# EAGLE design controller_v2 (EAGLE 7.1.0)
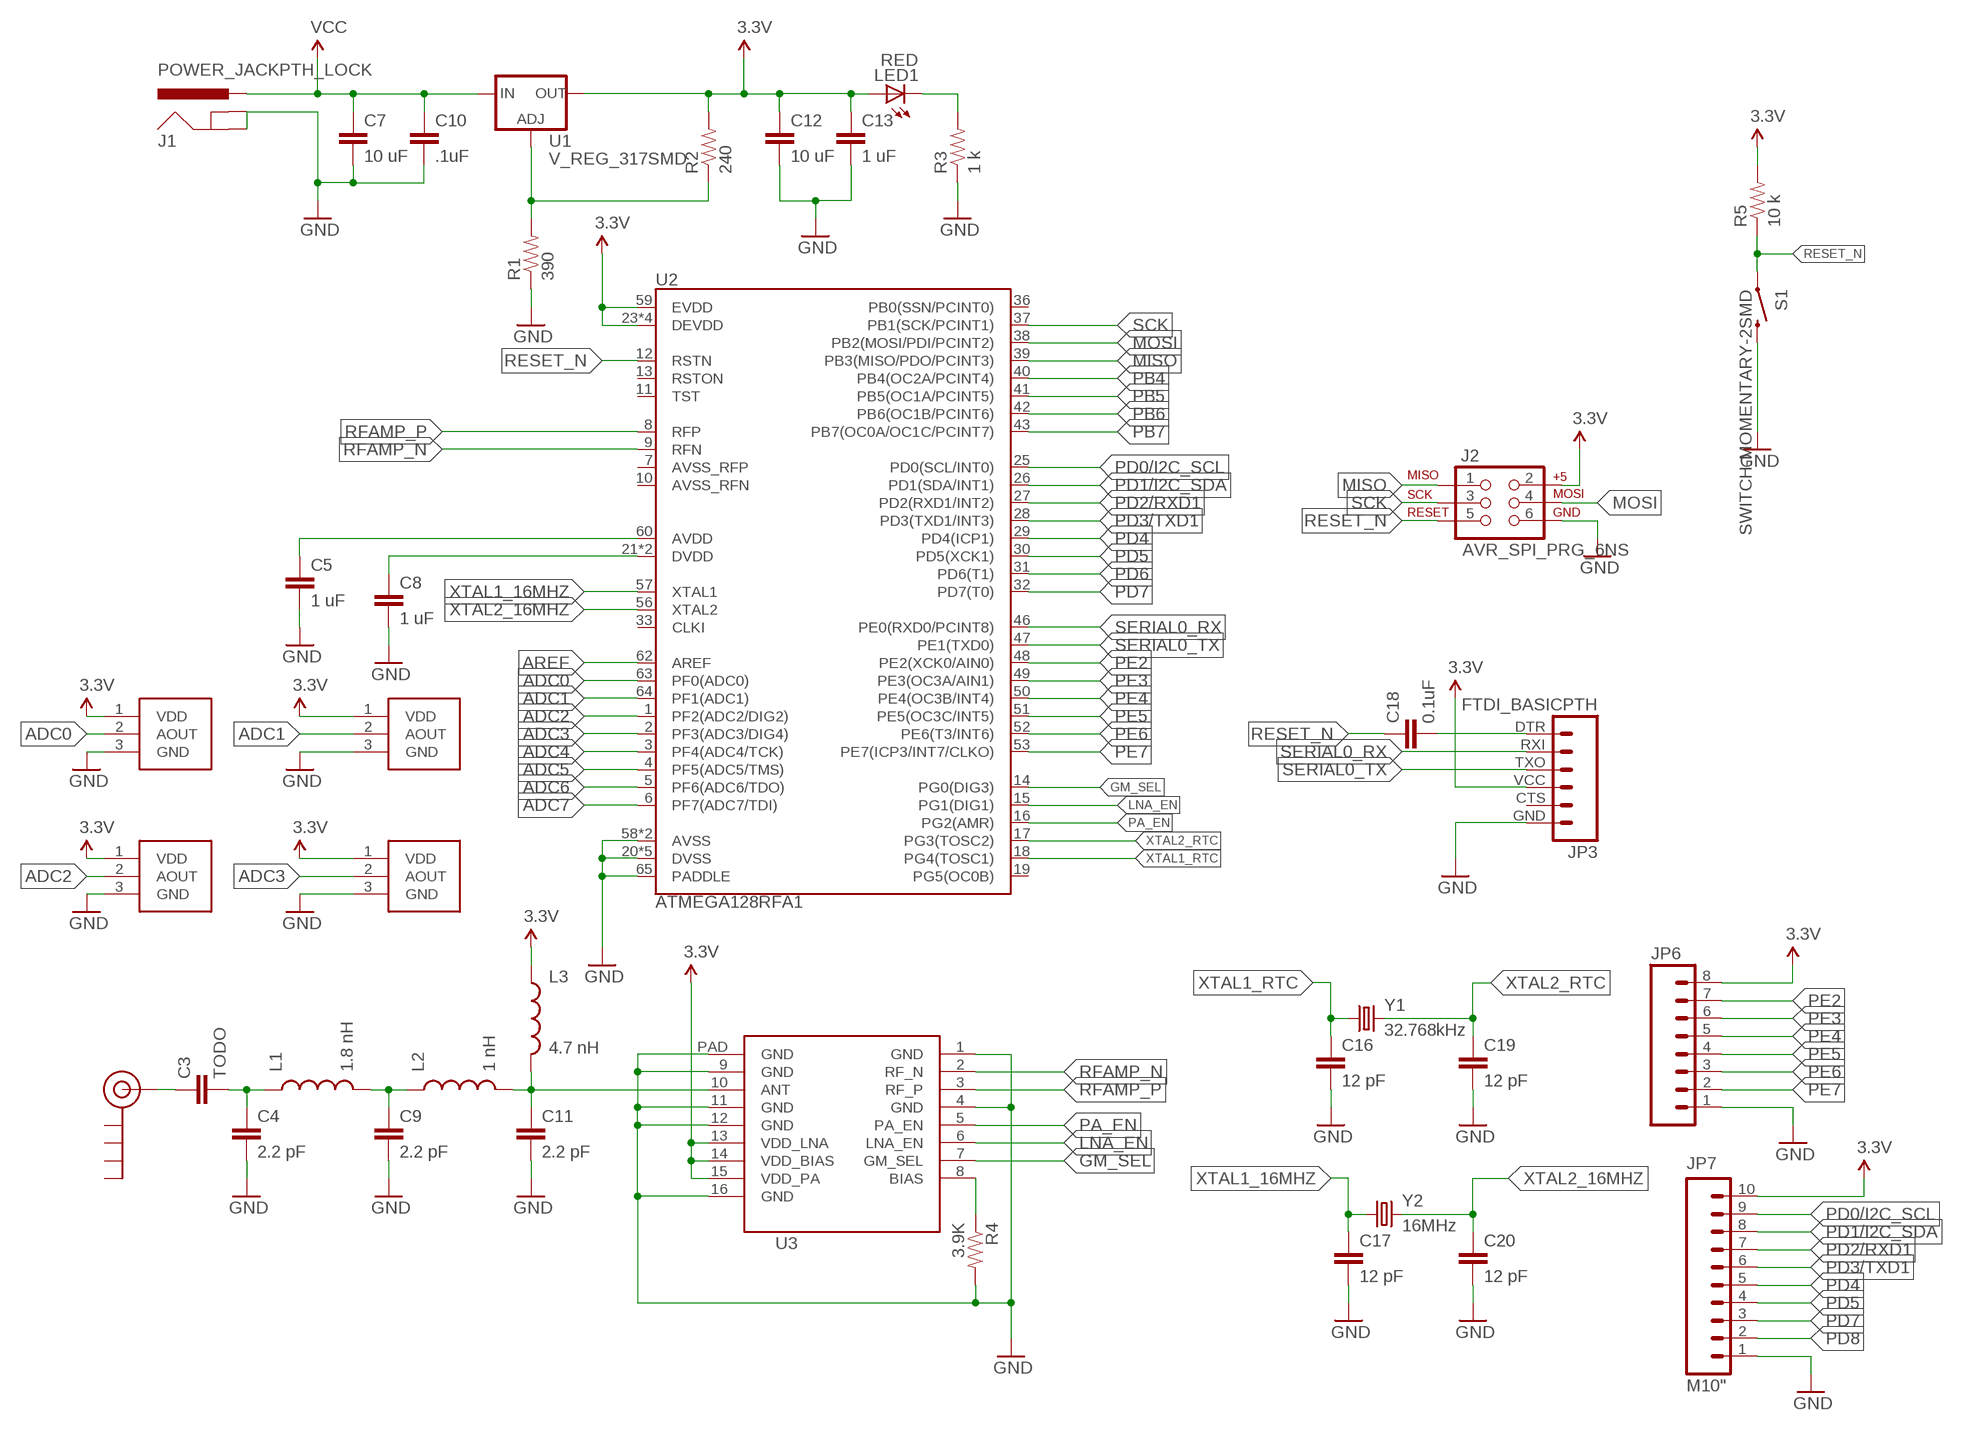
[diagram p0: schematic, sheet 1]

## Parts
C3  TODO  CAP0805  [0805]
C4  2.2 pF  CAP0805  [0805]
C5  1 uF  CAP0805  [0805]
C7  10 uF  CAP0805  [0805]
C8  1 uF  CAP0805  [0805]
C9  2.2 pF  CAP0805  [0805]
C10  .1uF  CAP0805  [0805]
C11  2.2 pF  CAP0805  [0805]
C12  10 uF  CAP0805  [0805]
C13  1 uF  CAP0805  [0805]
C16  12 pF  CAP0805  [0805]
C17  12 pF  CAP0805  [0805]
C18  0.1uF  CAP0805  [0805]
C19  12 pF  CAP0805  [0805]
C20  12 pF  CAP0805  [0805]
J1  POWER_JACKPTH_LOCK  [POWER_JACK_PTH_LOCK]
J2  AVR_SPI_PRG_6NS  [2X3-NS]
J3  GIMBAL_3PIN  [JST-3-PTH]
J4  GIMBAL_3PIN  [JST-3-PTH]
J5  GIMBAL_3PIN  [JST-3-PTH]
J6  GIMBAL_3PIN  [JST-3-PTH]
J$1  SMA_EDGE  [SMA-EDGE]
JP3  FTDI_BASICPTH  [FTDI_BASIC]
JP6  M081X08  [1X08]
JP7  M10"  [1X10]
L1  1.8 nH  INDUCTOR0805  [0805]
L2  1 nH  INDUCTOR0805  [0805]
L3  4.7 nH  INDUCTOR0805  [0805]
LED1  RED  LED0603  [LED-0603]
R1  390  RESISTOR0805-RES  [0805]
R2  240  RESISTOR0805-RES  [0805]
R3  1 k  RESISTOR0805-RES  [0805]
R4  3.9K  RESISTOR0805-RES  [0805]
R5  10 k  RESISTOR0805-RES  [0805]
S1  SWITCH-MOMENTARY-2SMD  [TACTILE_SWITCH_SMD]
U1  V_REG_317SMD  [SOT223]
U2  ATMEGA128RFA1  [QFN-64]
U3  RF_AMPLIFIER  CC2592QF  [QFN65P400X400X100-17N]
Y1  32.768kHz  CRYSTAL32-SMD  [CRYSTAL-32KHZ-SMD]
Y2  16MHz  CRYSTAL5X3  [CRYSTAL-SMD-5X3]

## Nets
3.3V: C12.1 C13.1 J2.2 J3.1(VDD) J4.1(VDD) J5.1(VDD) J6.1(VDD) JP3.VCC JP6.8 JP7.10 L3.1 LED1.A R2.2 R5.2 U1.2(OUT) U2.23(DEVDD) U2.34(DEVDD) U2.44(DEVDD) U2.54(DEVDD) U2.59(EVDD) U3.13(VDD_LNA) U3.14(VDD_BIAS) U3.15(VDD_PA)
ADC0: J6.2(AOUT) U2.63(PF0(ADC0))
ADC1: J3.2(AOUT) U2.64(PF1(ADC1))
ADC2: J5.2(AOUT) U2.1(PF2(ADC2/DIG2))
ADC3: J4.2(AOUT) U2.2(PF3(ADC3/DIG4))
ADC4: U2.3(PF4(ADC4/TCK))
ADC5: U2.4(PF5(ADC5/TMS))
ADC6: U2.5(PF6(ADC6/TDO))
ADC7: U2.6(PF7(ADC7/TDI))
AREF: U2.62(AREF)
GM_SEL: U2.14(PG0(DIG3)) U3.7(GM_SEL)
GND: C4.2 C5.2 C7.2 C8.2 C9.2 C10.2 C11.2 C12.2 C13.2 C16.2 C17.2 C19.2 C20.2 J1.GND J1.GNDBREAK J2.6 J3.3(GND) J4.3(GND) J5.3(GND) J6.3(GND) JP3.GND JP6.1 JP7.1 R1.1 R3.1 R4.2 S1.3 U2.20(DVSS) U2.24(DVSS) U2.35(DVSS) U2.45(DVSS) U2.55(DVSS) U2.58(AVSS) U2.61(AVSS) U2.65(PADDLE) U3.1(GND) U3.4(GND) U3.9(GND) U3.11(GND) U3.12(GND) U3.16(GND) U3.PAD(GND)
LNA_EN: U2.15(PG1(DIG1)) U3.6(LNA_EN)
MISO: J2.1 U2.39(PB3(MISO/PDO/PCINT3))
MOSI: J2.4 U2.38(PB2(MOSI/PDI/PCINT2))
N$1: C9.1 L1.2 L2.1
N$2: C18.2 JP3.DTR
N$3: C11.1 L2.2 L3.2 U3.10(ANT)
N$4: C3.2 C4.1 L1.1
N$7: R4.1 U3.8(BIAS)
N$8: C3.1 J$1.SIG(SIGNAL)
N$13: R1.2 R2.1 U1.1(ADJ)
N$14: LED1.C R3.2
N$15: C5.1 U2.60(AVDD)
N$16: C8.1 U2.21(DVDD) U2.22(DVDD)
PA_EN: U2.16(PG2(AMR)) U3.5(PA_EN)
PB4: U2.40(PB4(OC2A/PCINT4))
PB5: U2.41(PB5(OC1A/PCINT5))
PB6: U2.42(PB6(OC1B/PCINT6))
PB7: U2.43(PB7(OC0A/OC1C/PCINT7))
PD0/I2C_SCL: JP7.9 U2.25(PD0(SCL/INT0))
PD1/I2C_SDA: JP7.8 U2.26(PD1(SDA/INT1))
PD2/RXD1: JP7.7 U2.27(PD2(RXD1/INT2))
PD3/TXD1: JP7.6 U2.28(PD3(TXD1/INT3))
PD4: JP7.5 U2.29(PD4(ICP1))
PD5: JP7.4 U2.30(PD5(XCK1))
PD6: U2.31(PD6(T1))
PD7: JP7.3 U2.32(PD7(T0))
PD8: JP7.2
PE2: JP6.7 U2.48(PE2(XCK0/AIN0))
PE3: JP6.6 U2.49(PE3(OC3A/AIN1))
PE4: JP6.5 U2.50(PE4(OC3B/INT4))
PE5: JP6.4 U2.51(PE5(OC3C/INT5))
PE6: JP6.3 U2.52(PE6(T3/INT6))
PE7: JP6.2 U2.53(PE7(ICP3/INT7/CLKO))
RESET_N: C18.1 J2.5 R5.1 S1.1 U2.12(RSTN)
RFAMP_N: U2.9(RFN) U3.2(RF_N)
RFAMP_P: U2.8(RFP) U3.3(RF_P)
SCK: J2.3 U2.37(PB1(SCK/PCINT1))
SERIAL0_RX: JP3.RXI U2.46(PE0(RXD0/PCINT8))
SERIAL0_TX: JP3.TXO U2.47(PE1(TXD0))
VCC: C7.1 C10.1 J1.PWR U1.3(IN)
XTAL1_16MHZ: C17.1 U2.57(XTAL1) Y2.1
XTAL1_RTC: C16.1 U2.18(PG4(TOSC1)) Y1.X1
XTAL2_16MHZ: C20.1 U2.56(XTAL2) Y2.3
XTAL2_RTC: C19.1 U2.17(PG3(TOSC2)) Y1.X2
Unconnected: J$1.GND@0(GND) J$1.GND@1(GND) J$1.GND@2(GND) J$1.GND@3(GND) JP3.CTS U2.7(AVSS_RFP) U2.10(AVSS_RFN) U2.11(TST) U2.13(RSTON) U2.19(PG5(OC0B)) U2.33(CLKI) U2.36(PB0(SSN/PCINT0))

## Library data of the parts
C3-C5 C8 C9 C11 C16-C20 = Controller:CAP: Capacitor Standard 0603 ceramic capacitor, and 0.1" leaded capacitor.
C7 C10 C12 C13 = ATmega128RFA1-DevBoard:CAP: Capacitor Standard 0603 ceramic capacitor, and 0.1" leaded capacitor.
J1 = Controller:POWER_JACK: Power Jack This is the standard 5.5mm barrel jack for power. The PTH is the most common, proven, reliable, footprint. The Slot footprint only works if the mill layer is transmitted to the PCB fab house so be warned. Spark Fun Electronics SKU : PRT-00119 SMT: CONN-08106 Mating wall wart : TOL-00298 (and others)
J2 = Controller:AVR_SPI_PRG_6: AVR ISP 6 Pin This is the reduced ISP connector for AVR programming. Common on Arduino. This footprint will take up less PCB space and can be used with a 10-pin to 6-pin adapter such as SKU: BOB-08508
J3-J6 = Controller:GIMBAL_3PIN: This is the surface mount connector for the 9XR Replacement Gimbal. It uses a 3 Pin, 2 mm Pitch, JST connector (https://www.sparkfun.com/products/9750) You can see the analog transmitter here: http://www.hobbyking.com/hobbyking/store/__39505__Transmitter_Gimbal_Set_Left_Turnigy_9XR_Transmitter_Mode_1.html The black wire is VDD, the White wire is Ground, the Red wire is Analog Out Author: Dustin Richmond Created: 10/25/2014
J$1 = Controller:SMA_EDGE: SMA Antenna Connector End launch SMA connector. The paste layer has been removed so that the connector can be hand soldered onto the board after reflow.
JP3 = Controller:FTDI_BASIC: FTDI Basic header with labels
JP6 = Controller:M08: Header 8 Standard 8-pin 0.1" header. Use with straight break away headers (SKU : PRT-00116), right angle break away headers (PRT-00553), swiss pins (PRT-00743), machine pins (PRT-00117), and female headers (PRT-00115).
JP7 = Controller:M10: Header 10 Standard 10-pin 0.1" header. Use with straight break away headers (SKU : PRT-00116), right angle break away headers (PRT-00553), swiss pins (PRT-00743), machine pins (PRT-00117), and female headers (PRT-00115).
L1-L3 = Controller:INDUCTOR: Inductors Basic Inductor/Choke - 0603 and 1206. Footprints are not proven and vary greatly between part numbers. SRN6045- 33uH, 20% 1.4A SDR0403-560KL - 56uH, 10%, 500mA RMS/740mA peak
LED1 = Controller:LED: LEDs Standard schematic elements and footprints for 5mm, 3mm, 1206, and 0603 sized LEDs. 5mm - Spark Fun Electronics SKU : COM-00529 (and others)
R1 R2 = ATmega128RFA1-DevBoard:RESISTOR: Resistor Basic schematic elements and footprints for 0603, 1206, and PTH resistors.
R3-R5 = Controller:RESISTOR: Resistor Basic schematic elements and footprints for 0603, 1206, and PTH resistors.
S1 = Controller:SWITCH-MOMENTARY-2: Various NO switches- pushbuttons, reed, etc
U1 = Controller:V_REG_317: Voltage Regulator Standard LM317 adjustable voltage regulator. AOI (Adjust Output Input). Google 'LM317 Calculator' for easy to use app to get the two resistor values needed. 240/720 for 5V output. 240/390 for 3.3V output. Spark Fun Electronics SKU : COM-00527
U2 = Controller:ATMEGA128RFA1: ATmega128RFA1 8-bit AVR Microcontroller with Low Power 2.4GHz Transceiver for ZigBee and IEEE 802.15.4
U3 = Controller:CC2592: Device Symbol for the CC2592 QFN16 RF Amplifier Chip from Texas Instruments. Description: The CC2592 device is a cost-effective and high-performance RF front end for low-power and low-voltage 2.4-GHz wireless applications.The CC2592 device is a range extender for all CC25XX 2.4-GHz low-power RF transceivers, transmitters, and system-on-chip products from Texas Instruments.To increase the link budget, the CC2592 device provides a power amplifier for increased output power and an LNA with a low-noise figure for improved receiver sensitivity.The CC2592 device provides a very small size, high-output power RF design with its 4-mm × 4-mm QFN-16 package.The CC2592 device contains PA, LNA, switches, RF-matching, and balun for simple design of high-performance wireless applications Datasheet: http://www.ti.com/general/docs/lit/getliterature.tsp?genericPartNumber=cc2592&fileType=pdf Note: I have NOT added the thermal pads expected in the datasheet. These should be added by the end user on their PCB Author: Dustin Richmond Date Created: 10/16/2014 Reviewer 1: Reviewer 2:
Y1 Y2 = Controller:CRYSTAL: Various standard crystals. Proven footprints. Spark Fun Electronics SKU : COM-00534

## Board
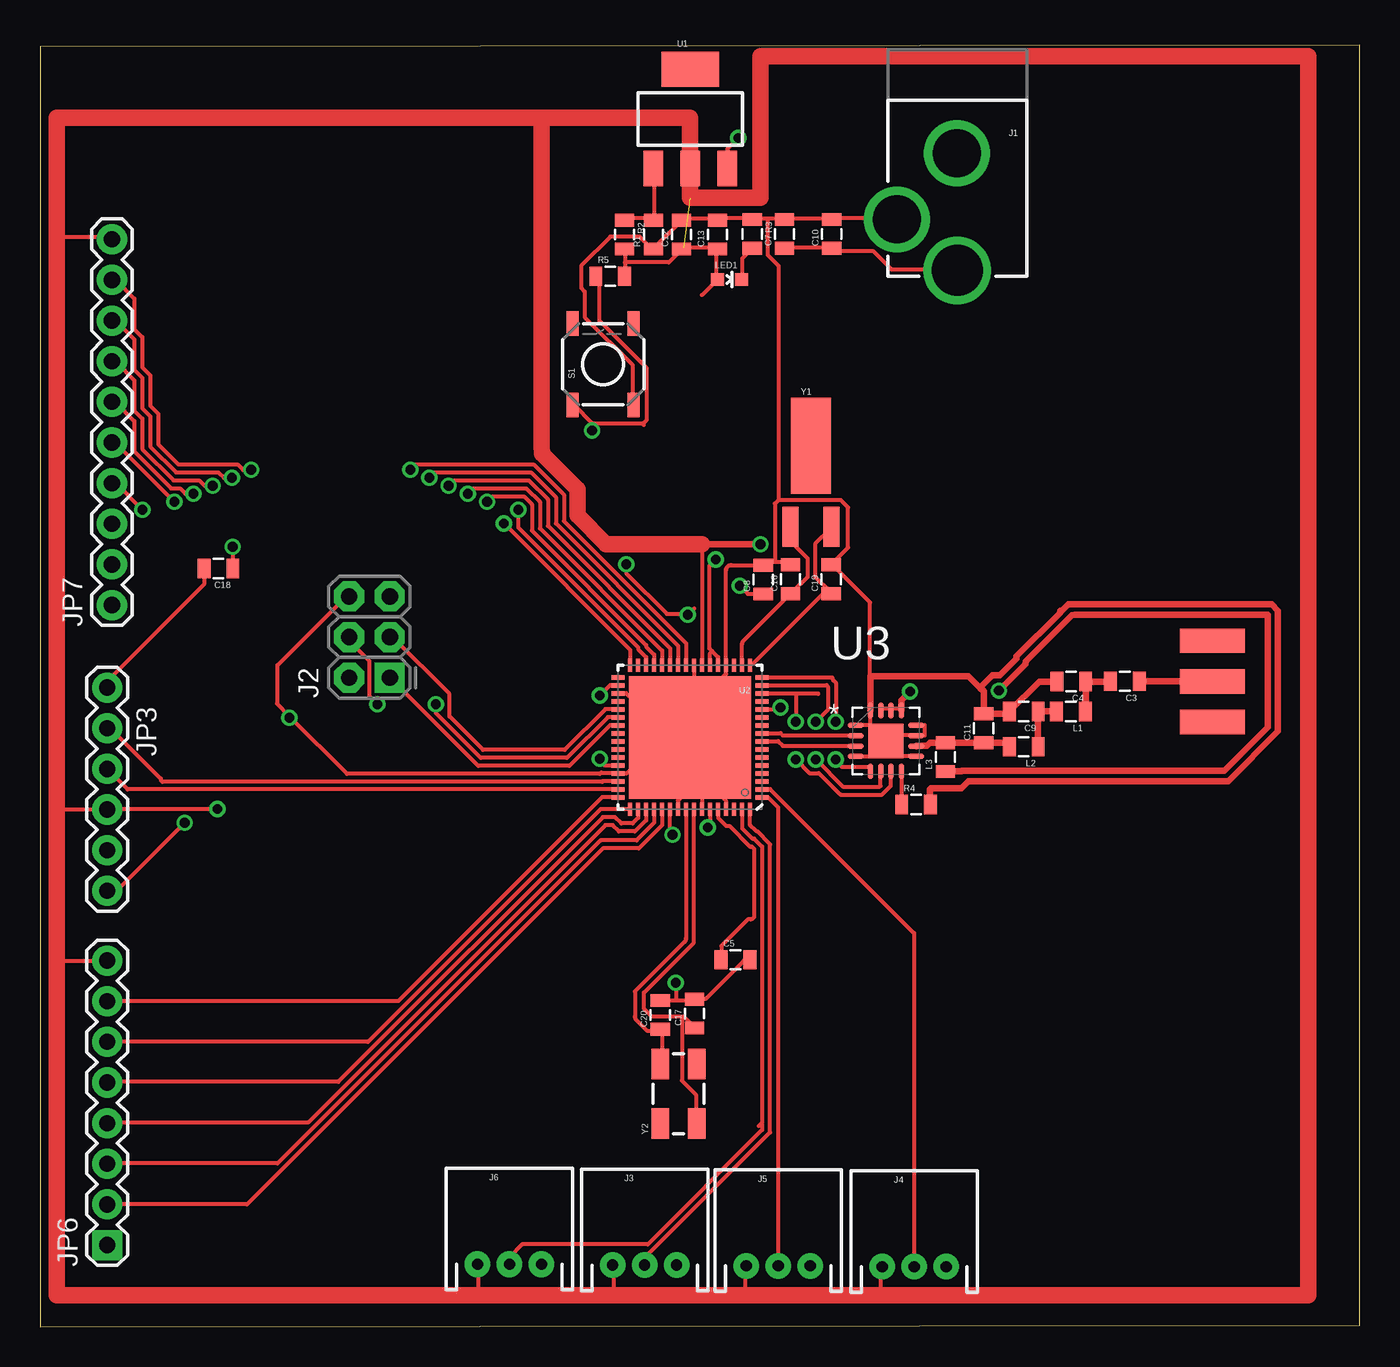
[diagram p1: board, top side]
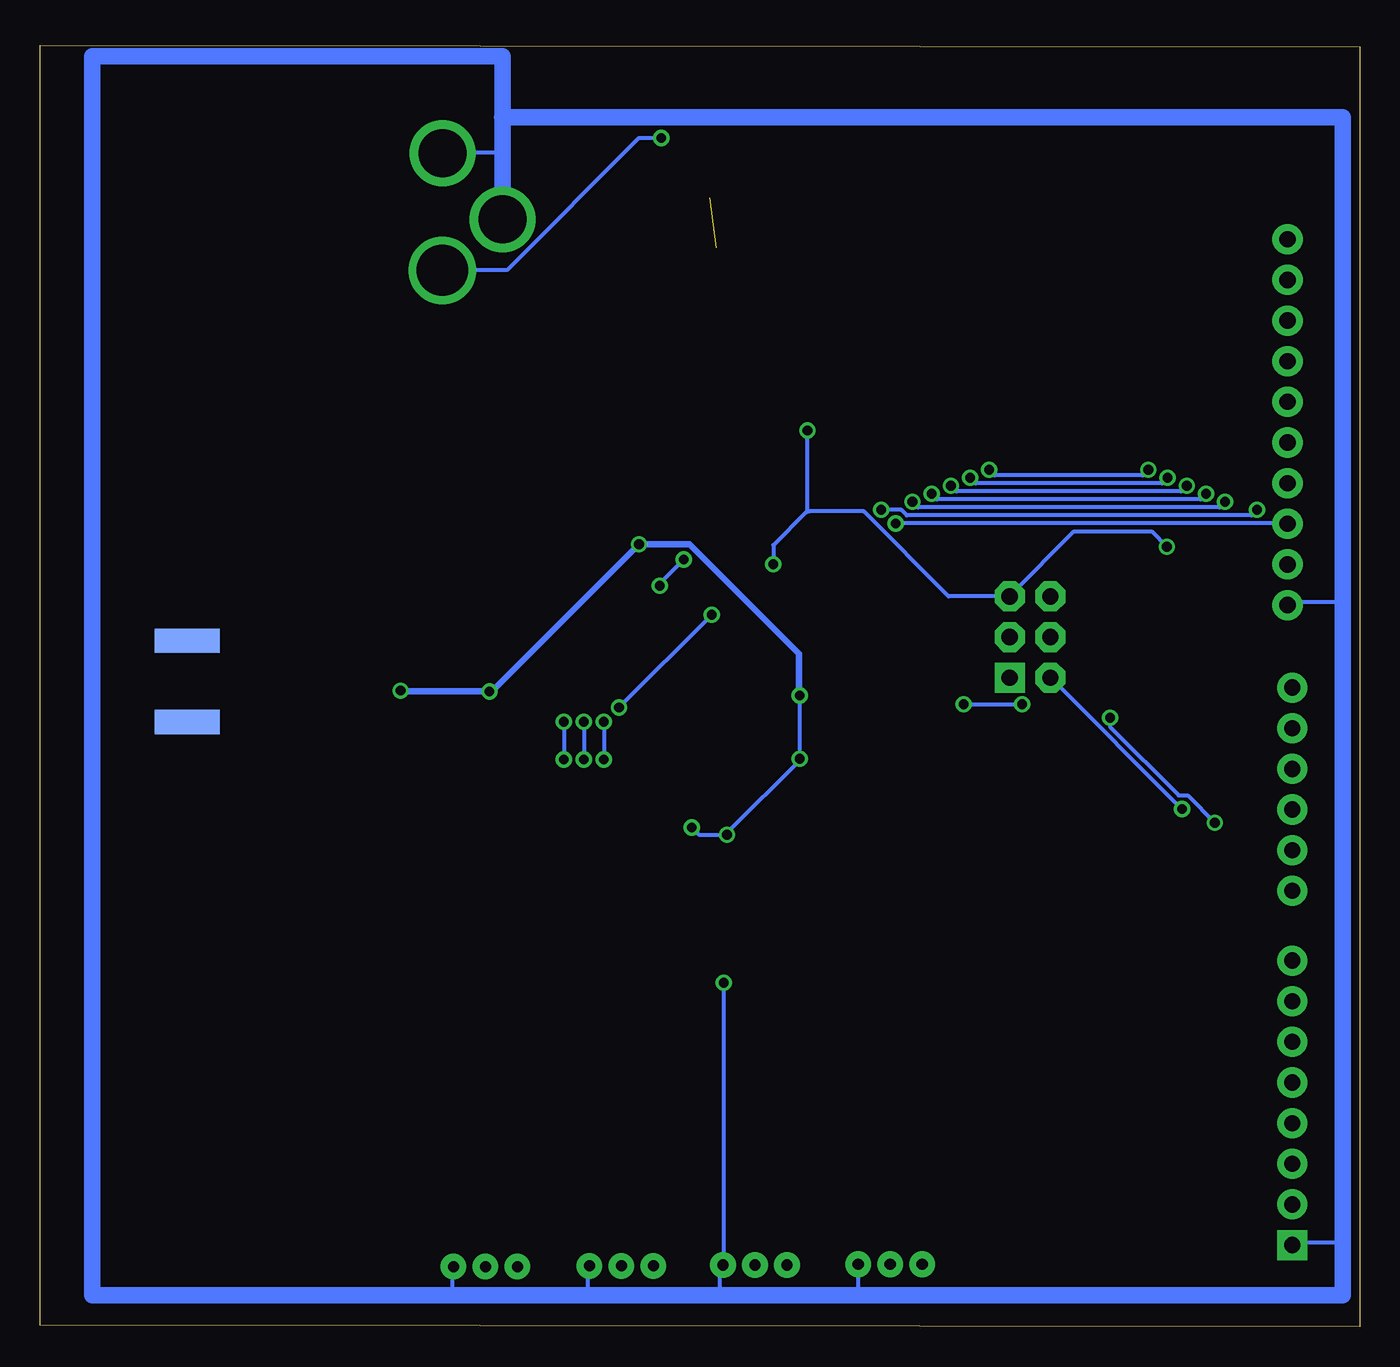
[diagram p2: board, bottom side, seen from below]

Size 82.5 x 80.1 mm. Coordinates in mm from the lower left corner, seen from the top.
Outline: 0,0 82.5,0.1 82.5,80.1 0,80 0,0
Copper layers (1*16): Top 0.035mm / dielectric 1.5mm / Bottom 0.035mm
Design rules "default": minimum track width 10mil, minimum drill 24mil, track to track 8mil, track to pad 8mil, pad to pad 8mil, via to via 8mil, smd to smd 8mil, copper to edge 40mil, drill to drill 8mil, minimum pad ring 10mil, minimum via ring 8mil, stop-mask expansion 4mil, vias tented up to drill 0mil, thermal gap 10mil

### Footprints (pad centres in the part's own frame; a part is rotated, then mirrored left to right if it is on the bottom)
0805 = smd 0.8 x 1.2: 1 -0.9,0; 2 0.9,0
POWER_JACK_PTH_LOCK = drill 2.997 pad 4.115: GND 0.025,6.557; GNDBREAK 3.762,10.7 | drill 3.2 pad 4.115: PWR 0,13.878
2X3-NS = drill 1.016 pad 1.88 square: 1 -2.54,-1.27 | drill 1.016 pad 1.88 octagon: 2 -2.54,1.27; 3 0,-1.27; 4 0,1.27; 5 2.54,-1.27; 6 2.54,1.27
JST-3-PTH = drill 0.7 pad 1.6: 1 -2,0; 2 0,0; 3 2,0
SMA-EDGE = smd 1.524 x 4.064: GND@0 0,0; GND@1 5.08,0; SIG 2.54,0 | smd 1.524 x 4.064 bottom: GND@2 0,0; GND@3 5.08,0
FTDI_BASIC = drill 1.016 pad 1.88: CTS 10.16,0; DTR 0,0; GND 12.7,0; RXI 2.54,0; TXO 5.08,0; VCC 7.62,0
1X08 = drill 1.016 pad 1.88 square: 1 0,0 | drill 1.016 pad 1.88: 2 2.54,0; 3 5.08,0; 4 7.62,0; 5 10.16,0; 6 12.7,0; 7 15.24,0; 8 17.78,0
1X10 = drill 1.016 pad 1.88: 1 0,0; 2 2.54,0; 3 5.08,0; 4 7.62,0; 5 10.16,0; 6 12.7,0; 7 15.24,0; 8 17.78,0; 9 20.32,0; 10 22.86,0
LED-0603 = smd 0.8 x 0.8: A 0,-0.75; C 0,0.75
TACTILE_SWITCH_SMD = smd 1.524 x 0.762: 1 -2.54,1.905; 2 2.54,1.905; 3 -2.54,-1.905; 4 2.54,-1.905
SOT223 = smd 1.219 x 2.235: 1 -2.311,-3.099; 2 0,-3.099; 3 2.311,-3.099 | smd 3.6 x 2.2: 4 0,3.099
QFN-64 = smd 0.8 x 0.28: 1 -4.5,3.75; 2 -4.5,3.25; 3 -4.5,2.75; 4 -4.5,2.25; 5 -4.5,1.75; 6 -4.5,1.25; 7 -4.5,0.75; 8 -4.5,0.25; 9 -4.5,-0.25; 10 -4.5,-0.75; 11 -4.5,-1.25; 12 -4.5,-1.75; 13 -4.5,-2.25; 14 -4.5,-2.75; 15 -4.5,-3.25; 16 -4.5,-3.75; 33 4.5,-3.75; 34 4.5,-3.25; 35 4.5,-2.75; 36 4.5,-2.25; 37 4.5,-1.75; 38 4.5,-1.25; 39 4.5,-0.75; 40 4.5,-0.25; 41 4.5,0.25; 42 4.5,0.75; 43 4.5,1.25; 44 4.5,1.75; 45 4.5,2.25; 46 4.5,2.75; 47 4.5,3.25; 48 4.5,3.75 | smd 0.28 x 0.8: 17 -3.75,-4.5; 18 -3.25,-4.5; 19 -2.75,-4.5; 20 -2.25,-4.5; 21 -1.75,-4.5; 22 -1.25,-4.5; 23 -0.75,-4.5; 24 -0.25,-4.5; 25 0.25,-4.5; 26 0.75,-4.5; 27 1.25,-4.5; 28 1.75,-4.5; 29 2.25,-4.5; 30 2.75,-4.5; 31 3.25,-4.5; 32 3.75,-4.5; 49 3.75,4.5; 50 3.25,4.5; 51 2.75,4.5; 52 2.25,4.5; 53 1.75,4.5; 54 1.25,4.5; 55 0.75,4.5; 56 0.25,4.5; 57 -0.25,4.5; 58 -0.75,4.5; 59 -1.25,4.5; 60 -1.75,4.5; 61 -2.25,4.5; 62 -2.75,4.5; 63 -3.25,4.5; 64 -3.75,4.5 | smd 7.65 x 7.65: 65 0,0
QFN65P400X400X100-17N = smd 1 x 0.35: 1 -1.9,0.975; 2 -1.9,0.325; 3 -1.9,-0.325; 4 -1.9,-0.975; 9 1.9,-0.975; 10 1.9,-0.325; 11 1.9,0.325; 12 1.9,0.975 | smd 0.35 x 1: 5 -0.975,-1.9; 6 -0.325,-1.9; 7 0.325,-1.9; 8 0.975,-1.9; 13 0.975,1.9; 14 0.325,1.9; 15 -0.325,1.9; 16 -0.975,1.9 | smd 2.16 x 2.16: PAD 0,0
CRYSTAL-32KHZ-SMD = smd 2.5 x 6: SHEILD 0,5.08 | smd 1 x 2.5: X1 -1.27,0; X2 1.27,0
CRYSTAL-SMD-5X3 = smd 1.9 x 1.1: 1 -1.85,-1.15; 2 1.85,-1.15; 3 1.85,1.15; 4 -1.85,1.15

### Placement (x,y rotation side)
C3  67.83,40.33 180 top
C4  64.48,40.32 180 top
C5  43.48,22.93 0 top
C7  46.55,68.3 90 top
C8  45.22,46.69 90 top
C9  61.5,38.45 180 top
C10  49.5,68.3 90 top
C11  59,37.4 90 top
C12  40.1,68.25 90 top
C13  42.35,68.25 90 top
C16  46.93,46.71 90 top
C17  40.93,19.57 90 top
C18  11.16,47.39 180 top
C19  49.47,46.71 90 top
C20  38.78,19.48 90 top
J1  57.35,79.9 180 top
J2  20.6,43.1 90 top
J3  37.8,3.85 0 top
J4  54.65,3.75 0 top
J5  46.15,3.8 0 top
J6  29.35,3.9 0 top
J$1  73.29,42.87 270 top
JP3  4.2,39.94 270 top
JP6  4.2,5.1 90 top
JP7  4.5,45.1 90 top
L1  64.45,38.45 180 top
L2  61.5,36.25 180 top
L3  56.6,35.6 90 top
LED1  43.1,65.45 270 top
R1  38.35,68.25 90 top
R2  36.55,68.25 270 top
R3  44.53,68.3 270 top
R4  54.77,32.63 0 top
R5  35.65,65.65 0 top
S1  35.21,60.15 90 top
U1  40.66,75.48 0 top
U2  40.64,36.83 180 top
U3  52.89,36.61 0 top
Y1  48.2,49.99 0 top
Y2  39.92,14.56 90 top

### Tracks (layer width: path | path; a pad name or v marks a point on that pad's centre or on a via)
3.3V  (via drill 0.6, 0.61)  (1 unrouted)
  Top 0.254: 36.58,66.52 36.58,67.21 R2.2 | 36.58,66.52 36.58,65.84 R5.2 | 36.58,66.52 39.32,66.52 40.01,67.21 C12.1 40.23,67.44 42.29,67.44 C13.1 42.29,67.21 42.29,65.61 LED1.A 42.29,65.38 41.38,64.47 | 41.38,48.9 41.38,41.38 U2.23 | 53.26,38.63 52.58,38.63 U3.15 | 53.26,38.63 53.72,38.63 U3.13 | 53.26,38.63 U3.14 | 56.46,34.52 L3.1 | 27.43,1.95 27.43,3.89 J6.1 | 35.89,1.95 35.89,3.66 J3.1 | 44.12,1.95 44.12,3.66 J5.1 | 52.58,1.95 52.58,3.66 J4.1 | 1.05,22.86 4.12,22.86 JP6.8 | 1.05,68.12 4.34,68.12 JP7.10 | v39.55,30.75 39.4,30.9 39.4,32.3 U2.54 | v41.75,31.2 41.9,31.35 41.9,32.3 U2.59 | v11.1,32.35 4.2,32.35 JP3.VCC 4.1,32.35 1.05,32.35 | v35,35.5 35,35.4 35.3,35.1 36.1,35.1 U2.44 | v35,39.45 35.65,40.1 36.1,40.1 U2.34
  Top 0.406: L3.1 57.6,34.7 57.65,34.75 74.05,34.75 76.75,37.45 76.75,44.5 64.7,44.5 64.5,44.45 61.65,41.6 61.6,41.4 v59.95,39.75 | v54.4,39.7 53.85,39.15 53.85,38.55 U3.13 | v45.05,48.9 41.38,48.9
  Top 1.016: U1.2 40.65,70.55 45.05,70.55 45.05,79.4 79.3,79.4 79.3,1.95 52.58,1.95 44.12,1.95 35.89,1.95 27.43,1.95 1.05,1.95 1.05,22.86 1.05,32.35 1.05,68.12 1.05,75.55 31.35,75.55 | 31.35,75.55 40.65,75.55 40.65,72.55 | 31.35,75.55 31.35,55.05 31.4,54.55 33.6,52.35 33.6,50.7 35.4,48.9 41.38,48.9
  Bottom 0.254: v39.55,30.75 41.3,30.75 v41.75,31.2 41.85,31.15 | 39.5,30.85 v39.55,30.75 | v11.1,32.35 19.3,40.55 J2.2 | v39.55,30.75 39.45,30.95 35,35.4 v35,35.5 v35,39.45
  Bottom 0.406: v59.95,39.75 59.9,39.7 v54.4,39.7 54.2,39.75 v45.05,48.9 41.9,48.9 35.05,42.05 35.05,39.55 v35,39.45
ADC0
  Top 0.254: 45.08,12.68 45.15,12.75 45.15,30 44.65,30.5 44.55,30.5 43.9,31.15 43.9,32.3 U2.63 | 45.08,12.68 44.95,12.55 | J6.2 29.35,4.35 30.15,5.15 38,5.15 45.15,12.3 45.15,12.6 45.08,12.68
ADC1
  Top 0.254: J3.2 37.8,4.3 45.65,12.15 45.65,30.15 44.85,30.95 44.75,31 44.4,31.35 44.4,32.3 U2.64
ADC2
  Top 0.254: J5.2 46.15,32.45 45.5,33.1 45.15,33.1 U2.1
ADC3
  Top 0.254: J4.2 54.65,24.6 45.65,33.6 45.15,33.6 U2.2
GM_SEL  (via drill 0.61)
  Top 0.254: U2.14 47.25,39.58 | 47.25,39.58 48.62,39.58 arc-90 48.65,39.55 | v47.25,35.45 48.1,34.6 48.7,34.6 50.05,33.25 52.65,33.25 53.2,33.8 53.2,34.7 U3.7 | 47.25,39.58 v47.25,37.8
  Bottom 0.254: v47.25,37.8 v47.25,35.45
GND  (via drill 0.61)
  Top 0.254: U3.PAD 52.85,36.6 52,36.6 51.95,36.55 51.95,35.7 51.9,35.65 51,35.65 U3.4 | U3.PAD 53,36.6 53.75,36.6 53.8,36.55 53.8,35.7 53.85,35.65 54.75,35.65 U3.9 | U3.PAD 53.75,36.7 53.75,36.9 53.8,36.95 54.75,36.95 U3.11 54.9,36.95 55.3,36.95 55.3,37.6 U3.12 | 51.85,37.6 U3.1 | 51.85,37.6 51.95,37.5 51.95,36.7 U3.PAD | 51.85,37.6 51.9,37.7 51.9,38.35 U3.16 | U2.58 41.38,32.46 41.38,36.12 40.69,36.8 U2.65 | U2.24 40.92,41.15 40.92,37.26 40.69,37.03 U2.65 | 45.95,47.78 46.86,47.78 C16.2 | 45.95,47.78 45.26,47.78 C8.2 43.21,47.59 arc90 42.89,47.27 U2.20 42.9,41.3 42.9,40.8 42.55,40.45 41,40.45 U2.65 | 51.91,40.65 51.89,40.69 51.89,45.26 49.61,47.55 C19.2 49.61,47.78 50.52,48.69 50.52,51.21 50.06,51.66 46.18,51.66 | 45.95,47.78 45.95,51.44 46.18,51.66 | 45.49,69.27 44.58,69.27 R3.1 44.35,69.27 42.52,69.27 C13.2 42.29,69.27 40.23,69.27 C12.2 40.01,69.04 38.41,67.44 R1.1 38.18,67.44 37.49,68.12 35.66,68.12 33.83,66.29 33.83,64.92 34.06,64.69 34.06,63.09 37.03,60.12 37.03,57.84 S1.3 | 45.49,69.27 46.41,69.27 C7.2 46.63,69.27 49.38,69.27 C10.2 49.61,69.27 53.49,69.27 J1.GNDBREAK | 46.18,51.66 46.18,66.29 45.49,66.98 45.49,69.27 | U2.55 39.88,32.38 39.88,32.88 41.25,34.25 U2.65 | U2.61 42.88,32.38 42.88,32.88 41.5,34.25 U2.65 | 39.75,20.38 40.88,20.38 C17.2 41,20.5 41.62,20.5 44,22.88 44.38,22.88 C5.2 | 39.75,20.38 38.88,20.38 C20.2 | v39.75,21.5 39.75,20.38 | 39.35,36.85 40.55,36.85 U2.65 | U2.65 39.3,36.95 36.65,39.6 36.15,39.6 U2.35 | 15.65,38.1 19.2,34.55 35,34.55 35.1,34.65 35.15,34.6 36.1,34.6 U2.45 36.25,34.6 36.7,34.6 39.1,37 U2.65 | 15.65,38.1 14.8,38.95 14.85,39.05 14.85,41.35 19.1,45.6 19.3,45.6 J2.6
  Top 0.254: v9.05,31.5 4.8,27.25 JP3.GND | v15.6,38.05 15.65,38.1
  Top 0.406: C4.2 62.47,40.32 C9.2 60.45,38.3 C11.2 59,39.7 58.77,39.92 | 58.77,39.92 58.05,40.65 51.91,40.65 U3.16 | R4.2 55.65,32.65 55.65,33.6 55.7,33.65 57.6,33.65 58.05,34.1 74.3,34.1 77.4,37.2 77.4,44.75 77,45.15 64.3,45.15 63.9,44.75 63.8,44.75 63.75,44.6 61.05,41.9 61.05,41.75 60,40.7 59.55,40.7 58.77,39.92
  Bottom 0.254: 31.32,1.95 31.32,3.89 J6.3 | 40.01,1.95 40.01,3.66 J3.3 39.75,3.88 v39.75,21.5 | 48.23,1.95 48.23,3.66 J5.3 | 56.69,1.95 56.69,3.66 J4.3 | 1.05,5.26 4.12,5.26 JP6.1 | 1.05,45.26 4.34,45.26 JP7.1 | 53.59,73.38 57.15,73.38 J1.GND | v9.05,31.5 10.75,33.2 11.3,33.2 15.6,37.5 v15.6,38.05
  Bottom 1.016: J1.GNDBREAK 53.59,73.38 53.59,79.4 79.25,79.4 79.25,1.95 56.69,1.95 48.23,1.95 40.01,1.95 31.32,1.95 1.05,1.95 1.05,5.26 1.05,45.26 1.05,75.6 53.6,75.6
LNA_EN  (via drill 0.61)
  Top 0.254: U2.15 49.18,40.08 | 49.18,40.08 arc90 49.2,40.1 | v48.5,35.45 50.2,33.75 52.5,33.75 52.55,33.8 U3.6 | v48.5,37.8 49.25,38.55 49.25,40 49.18,40.08
  Bottom 0.254: v48.5,37.8 v48.5,35.45
MISO
  Top 0.254: J2.1 21.9,40.55 27.4,35.05 33.1,35.05 35.65,37.6 36.1,37.6 U2.39
MOSI  (via drill 0.61)
  Top 0.254: v21.1,38.9 20.6,39.4 20.6,41.6 19.35,42.85 19.35,43.1 J2.4 | v24.75,38.9 24.75,38.35 27.55,35.55 32.95,35.55 35.5,38.1 36.1,38.1 U2.38
  Bottom 0.254: v24.75,38.9 v21.1,38.9
N$1
  Top 0.406: L2.1 C9.1 L1.2
N$2
  Top 0.254: JP3.DTR 4.2,40.35 10.25,46.4 10.25,47.35 C18.2
N$3
  Top 0.406: L2.2 60.35,36.5 C11.1 L3.2 55.65,36.5 55.45,36.3 54.8,36.3 U3.10
N$4
  Top 0.406: L1.1 65.38,38.45 C4.1 C3.2
N$7
  Top 0.254: R4.1 53.85,32.65 53.85,34.7 U3.8
N$8
  Top 0.406: C3.1 J$1.SIG
N$13
  Top 0.254: R2.1 36.58,69.27 38.18,69.27 R1.2 38.41,69.27 38.41,72.24 U1.1
N$14
  Top 0.254: LED1.C 43.89,65.61 43.89,66.75 44.35,67.21 R3.2
N$15
  Top 0.254: U2.60 42.4,32.3 42.4,31.8 42.9,31.3 43.1,31.3 44.4,30 44.5,30 44.65,29.85 44.65,25.6 44.55,25.5 44.45,25.45 44.25,25.45 42.6,23.8 42.6,22.95 C5.1
N$16  (via drill 0.61)
  Top 0.254: v43.75,46.3 44.25,45.8 45.2,45.8 C8.1 | v42.25,47.95 41.85,47.55 41.85,42.4 42.02,42.23 | 42.02,42.23 42.4,41.85 42.4,41.4 42.35,41.35 U2.21 | 42.02,42.23 41.9,42.1 41.9,41.35 U2.22
  Bottom 0.254: v43.75,46.3 43.75,46.45 v42.25,47.95
PA_EN  (via drill 0.61)
  Top 0.254: U2.16 49.47,40.58 arc-90 49.55,40.5 49.6,40.4 49.75,40.25 v49.75,37.8 | v49.75,35.45 49.75,35.35 50.1,35 51.9,35 51.9,34.75 U3.5
  Bottom 0.254: v49.75,37.8 v49.75,35.45
PD0/I2C_SCL  (via drill 0.61)
  Top 0.254: v23.15,53.55 23.5,53.9 30.85,53.9 32.75,52 32.75,50.35 40.4,42.7 40.4,41.35 U2.25 | v13.2,53.55 12.7,53.55 12.35,53.9 8.65,53.9 7.4,55.15 7.4,57.05 6.9,57.55 6.9,59.45 6.4,59.95 6.4,61.85 5.9,62.35 5.9,64.25 4.75,65.4 4.5,65.4 JP7.9
  Bottom 0.254: v23.15,53.55 22.8,53.2 13.55,53.2 v13.2,53.55
PD1/I2C_SDA  (via drill 0.61)
  Top 0.254: v24.35,53.05 24.7,53.4 30.7,53.4 32.25,51.85 32.25,50.2 39.9,42.55 39.9,41.35 U2.26 | v12,53.05 11.5,53.05 11.15,53.4 8.5,53.4 6.9,55 6.9,56.9 6.4,57.4 6.4,59.3 5.9,59.8 5.9,61.7 4.75,62.85 4.5,62.85 JP7.8
  Bottom 0.254: v24.35,53.05 24,52.7 12.35,52.7 v12,53.05
PD2/RXD1  (via drill 0.61)
  Top 0.254: v25.55,52.55 25.9,52.9 30.55,52.9 31.75,51.7 31.75,50.05 39.4,42.4 39.4,41.35 U2.27 | v10.8,52.55 10.3,52.55 9.95,52.9 8.35,52.9 6.4,54.85 6.4,56.75 5.9,57.25 5.9,59.15 4.75,60.3 4.5,60.3 JP7.7
  Bottom 0.254: v25.55,52.55 25.2,52.2 11.15,52.2 v10.8,52.55
PD3/TXD1  (via drill 0.61)
  Top 0.254: v26.75,52.05 27.1,52.4 30.4,52.4 31.25,51.55 31.25,49.9 38.9,42.25 38.9,41.35 U2.28 | v9.6,52.05 9.1,52.05 8.75,52.4 8.2,52.4 5.9,54.7 5.9,56.6 4.7,57.8 JP7.6
  Bottom 0.254: v26.75,52.05 26.4,51.7 9.95,51.7 v9.6,52.05
PD4  (via drill 0.61)
  Top 0.254: v27.95,51.55 28.3,51.9 30.25,51.9 30.75,51.4 30.75,49.75 37.9,42.6 37.9,42.5 38.4,42 38.4,41.35 U2.29 | v8.4,51.55 4.7,55.25 JP7.5
  Bottom 0.254: v27.95,51.55 27.6,51.2 8.75,51.2 v8.4,51.55
PD5  (via drill 0.61)
  Top 0.254: v29.9,51.05 29.9,49.95 37.4,42.45 37.4,42.35 37.9,41.85 37.9,41.35 U2.30 | v6.4,51.05 4.75,52.7 4.5,52.7 JP7.4
  Bottom 0.254: v29.9,51.05 28.65,51.05 28.3,50.7 6.75,50.7 v6.4,51.05
PD7  (via drill 0.61)
  Top 0.254: v29,50.2 36.9,42.3 36.9,41.35 U2.32
  Bottom 0.254: v29,50.2 4.5,50.2 JP7.3
PE2
  Top 0.254: JP6.7 22.4,20.35 35.15,33.1 36.1,33.1 U2.48
PE3
  Top 0.254: JP6.6 20.5,17.8 35.05,32.35 36.85,32.35 U2.49
PE4
  Top 0.254: JP6.5 4.2,15.3 18.65,15.3 35.2,31.85 35.95,31.85 36.35,31.45 37.05,31.45 37.4,31.8 37.4,32.3 U2.50
PE5
  Top 0.254: JP6.4 4.2,12.75 16.75,12.75 35.35,31.35 35.8,31.35 36.2,30.95 37.2,30.95 37.9,31.65 37.9,32.3 U2.51
PE6
  Top 0.254: JP6.3 4.2,10.2 14.85,10.2 35.05,30.4 37.3,30.4 38.4,31.5 38.4,32.3 U2.52
PE7
  Top 0.254: JP6.2 12.95,7.65 35.2,29.9 37.45,29.9 38.9,31.35 38.9,32.3 U2.53
RESET_N  (via drill 0.61)
  Top 0.254: 37.72,56.46 37.95,56.69 37.95,59.89 34.98,62.87 34.98,65.61 R5.1 | 34.52,56.46 37.72,56.46 | 34.52,56.46 33.38,57.61 S1.1 | v34.52,56.01 34.52,56.46 | 40.9,44.9 v40.5,44.5 40.4,44.55 39.2,44.55 36.65,47.1 v36.65,47.65 | v46.3,38.7 46.2,38.7 46.1,38.6 45.15,38.6 U2.12 | 37.75,56.35 37.72,56.46 | v12.05,48.75 C18.1
  Bottom 0.254: 34.52,50.98 v34.52,56.01 | v46.3,38.7 v40.5,44.5 | 34.52,50.98 34.4,50.95 31,50.95 25.7,45.65 21.9,45.65 J2.5 21.8,45.75 17.85,49.7 13,49.7 v12.05,48.75 | v36.65,47.65 36.65,48.85 34.6,50.9 34.52,50.98
RFAMP_N
  Top 0.254: U3.2 50.95,36.95 46.45,36.95 46.3,37.1 45.15,37.1 U2.9
RFAMP_P
  Top 0.254: U3.3 50.95,36.3 46.45,36.3 46.15,36.6 45.15,36.6 U2.8
SCK
  Top 0.254: J2.3 22.05,43.1 25.6,39.55 25.6,38.15 27.7,36.05 32.8,36.05 35.35,38.6 36.1,38.6 U2.37
SERIAL0_RX
  Top 0.254: U2.46 36.1,34.1 35.2,34.1 35.15,34.05 7.65,34.05 7.55,34.15 7.55,34.25 4.4,37.4 JP3.RXI
SERIAL0_TX
  Top 0.254: U2.47 5.48,33.58 JP3.TXO
VCC  (via drill 0.61)
  Top 0.254: C7.1 46.63,67.44 49.38,67.44 C10.1 49.61,67.21 52.12,67.21 53.26,66.06 57.15,66.06 J1.PWR | v43.66,74.3 42.98,73.61 42.98,72.47 U1.3
  Bottom 0.254: v43.66,74.3 45.03,74.3 53.26,66.06 57.15,66.06 J1.PWR
XTAL1_16MHZ
  Top 0.254: 40.12,19.38 40.25,19.38 40.88,18.75 C17.1 | 40.12,19.38 38.25,19.38 37.75,19.88 37.75,20.88 40.88,24 40.88,32.25 U2.57 | 40.12,19.38 40.12,15.38 41,14.5 41,12.75 Y2.1
XTAL1_RTC
  Top 0.254: Y1.X1 47.09,49.84 47.09,48.92 48.01,48.01 48.01,46.86 47.09,45.95 C16.1 43.98,42.86 arc45 43.89,42.64 U2.18
XTAL2_16MHZ
  Top 0.254: Y2.3 38.92,16.51 38.92,18.57 C20.1 arc-45 38.58,18.5 37.95,18.5 37.29,19.16 arc-45 37.2,19.38 37.2,20.95 40.3,24.05 arc45 40.39,24.27 U2.56
XTAL2_RTC
  Top 0.254: Y1.X2 49.38,49.84 48.46,48.92 48.46,46.86 49.38,45.95 C19.1 49.25,46.12 44.5,41.38 U2.17